# EAGLE design electric-imp (EAGLE 9.4.2)
Assembly variants: 10 mA, 50 mA

## Sheet 1 of 2
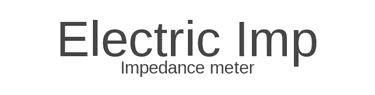
[diagram p0: schematic, sheet 1]

### Notes on the sheet
- Electric Imp
- Impedance meter

## Sheet 2 of 2: Power
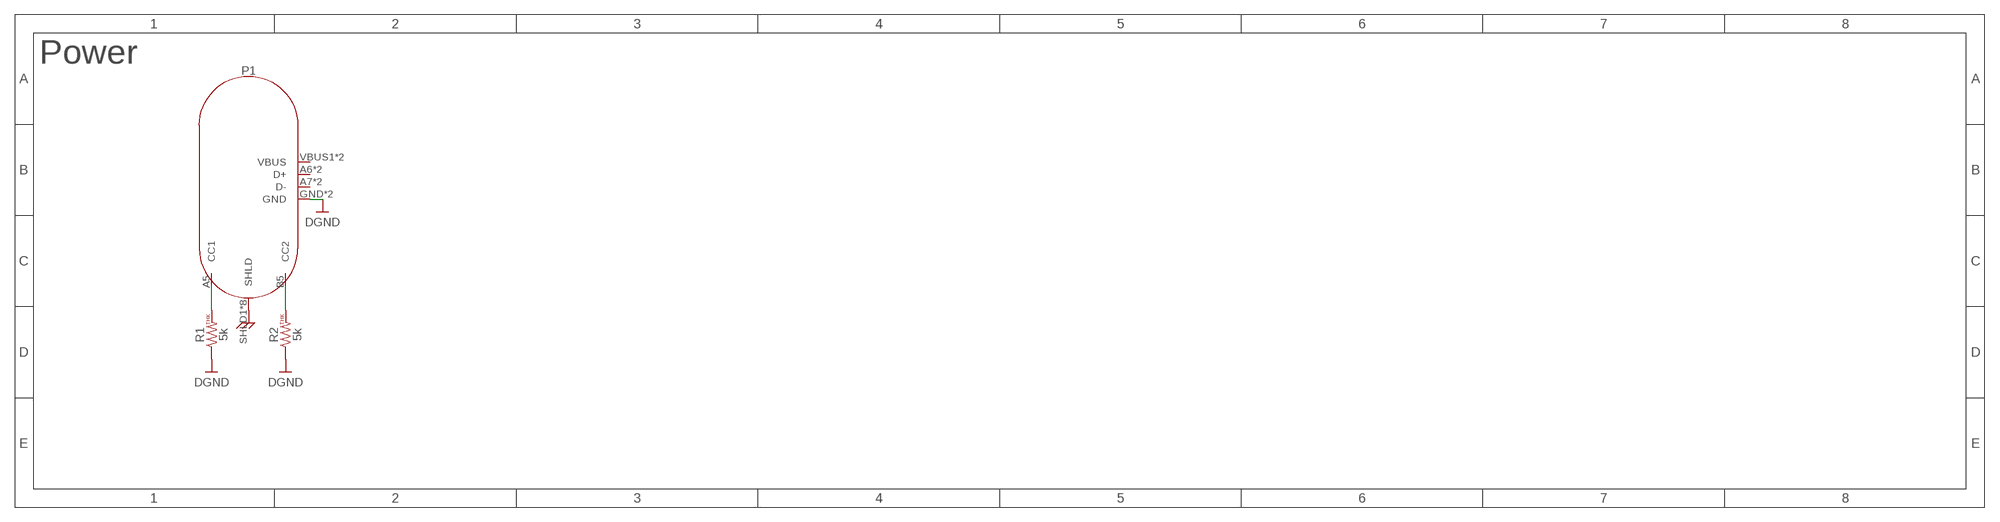
[diagram p1: schematic, sheet 2]

### Parts
P1  USB-C_2  [USB-C_2]
R1  5k  RESISTOR-5K-0603  [0603]
R2  5k  RESISTOR-5K-0603  [0603]

### Nets
DGND: P1.GND P1.GND2(GND) R1.1 R2.1
SHIELD: P1.SHLD1(SHLD) P1.SHLD2(SHLD) P1.SHLD3(SHLD) P1.SHLD4(SHLD) P1.SHLD5(SHLD) P1.SHLD6(SHLD) P1.SHLD7(SHLD) P1.SHLD8(SHLD)
UCPD1_CC1: P1.A5(CC1) R1.2
UCPD1_CC2: P1.B5(CC2) R2.2
Unconnected: P1.A6(D+) P1.A7(D-) P1.B6(D+) P1.B7(D-) P1.VBUS1(VBUS) P1.VBUS2(VBUS)

### Notes on the sheet
- Power

## Library data of the parts
P1 = usb:USB-C_2: USB-C connector with only USB-2.0 pins. Imported from Sparkfun connector library.; MANUF: BSC Electronics; PARTNUM: U06-CFXX5R-009-V1
R1 R2 = resistors:RESISTOR: Resistor, Thick Film; MANUF: Panasonic; PARTNUM: ERJ-3EKF4991V; TOLERANCE: 1%; TYPE: THICK FILM

## Net classes
0 default: width 0.25 mm, drill 0.15 mm

## Board
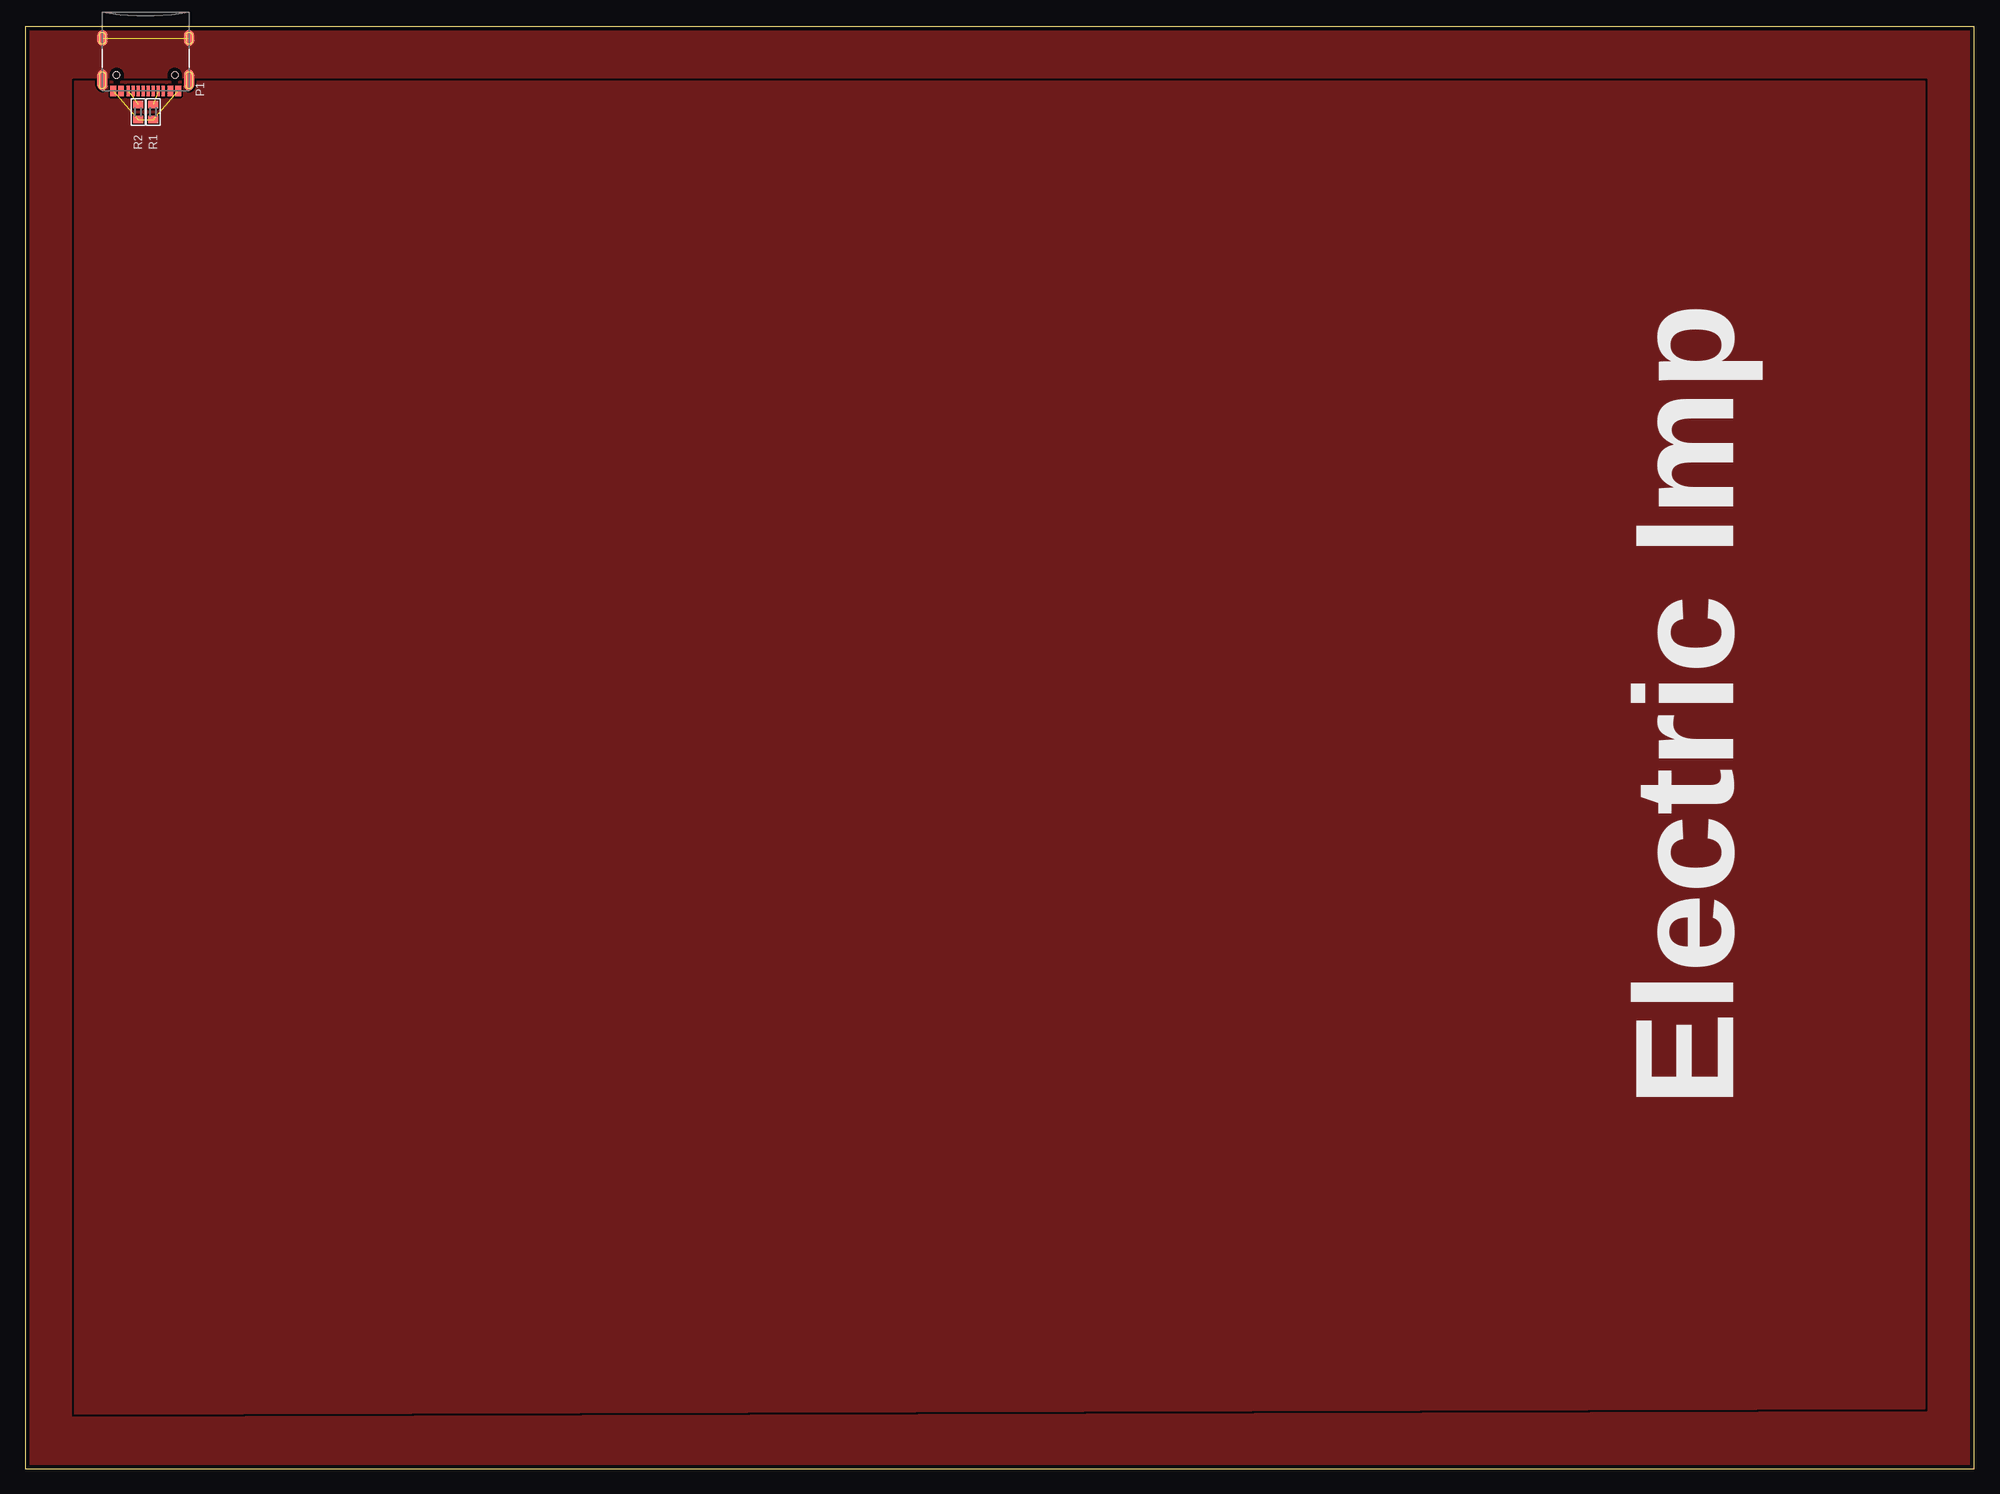
[diagram p2: board, top side]
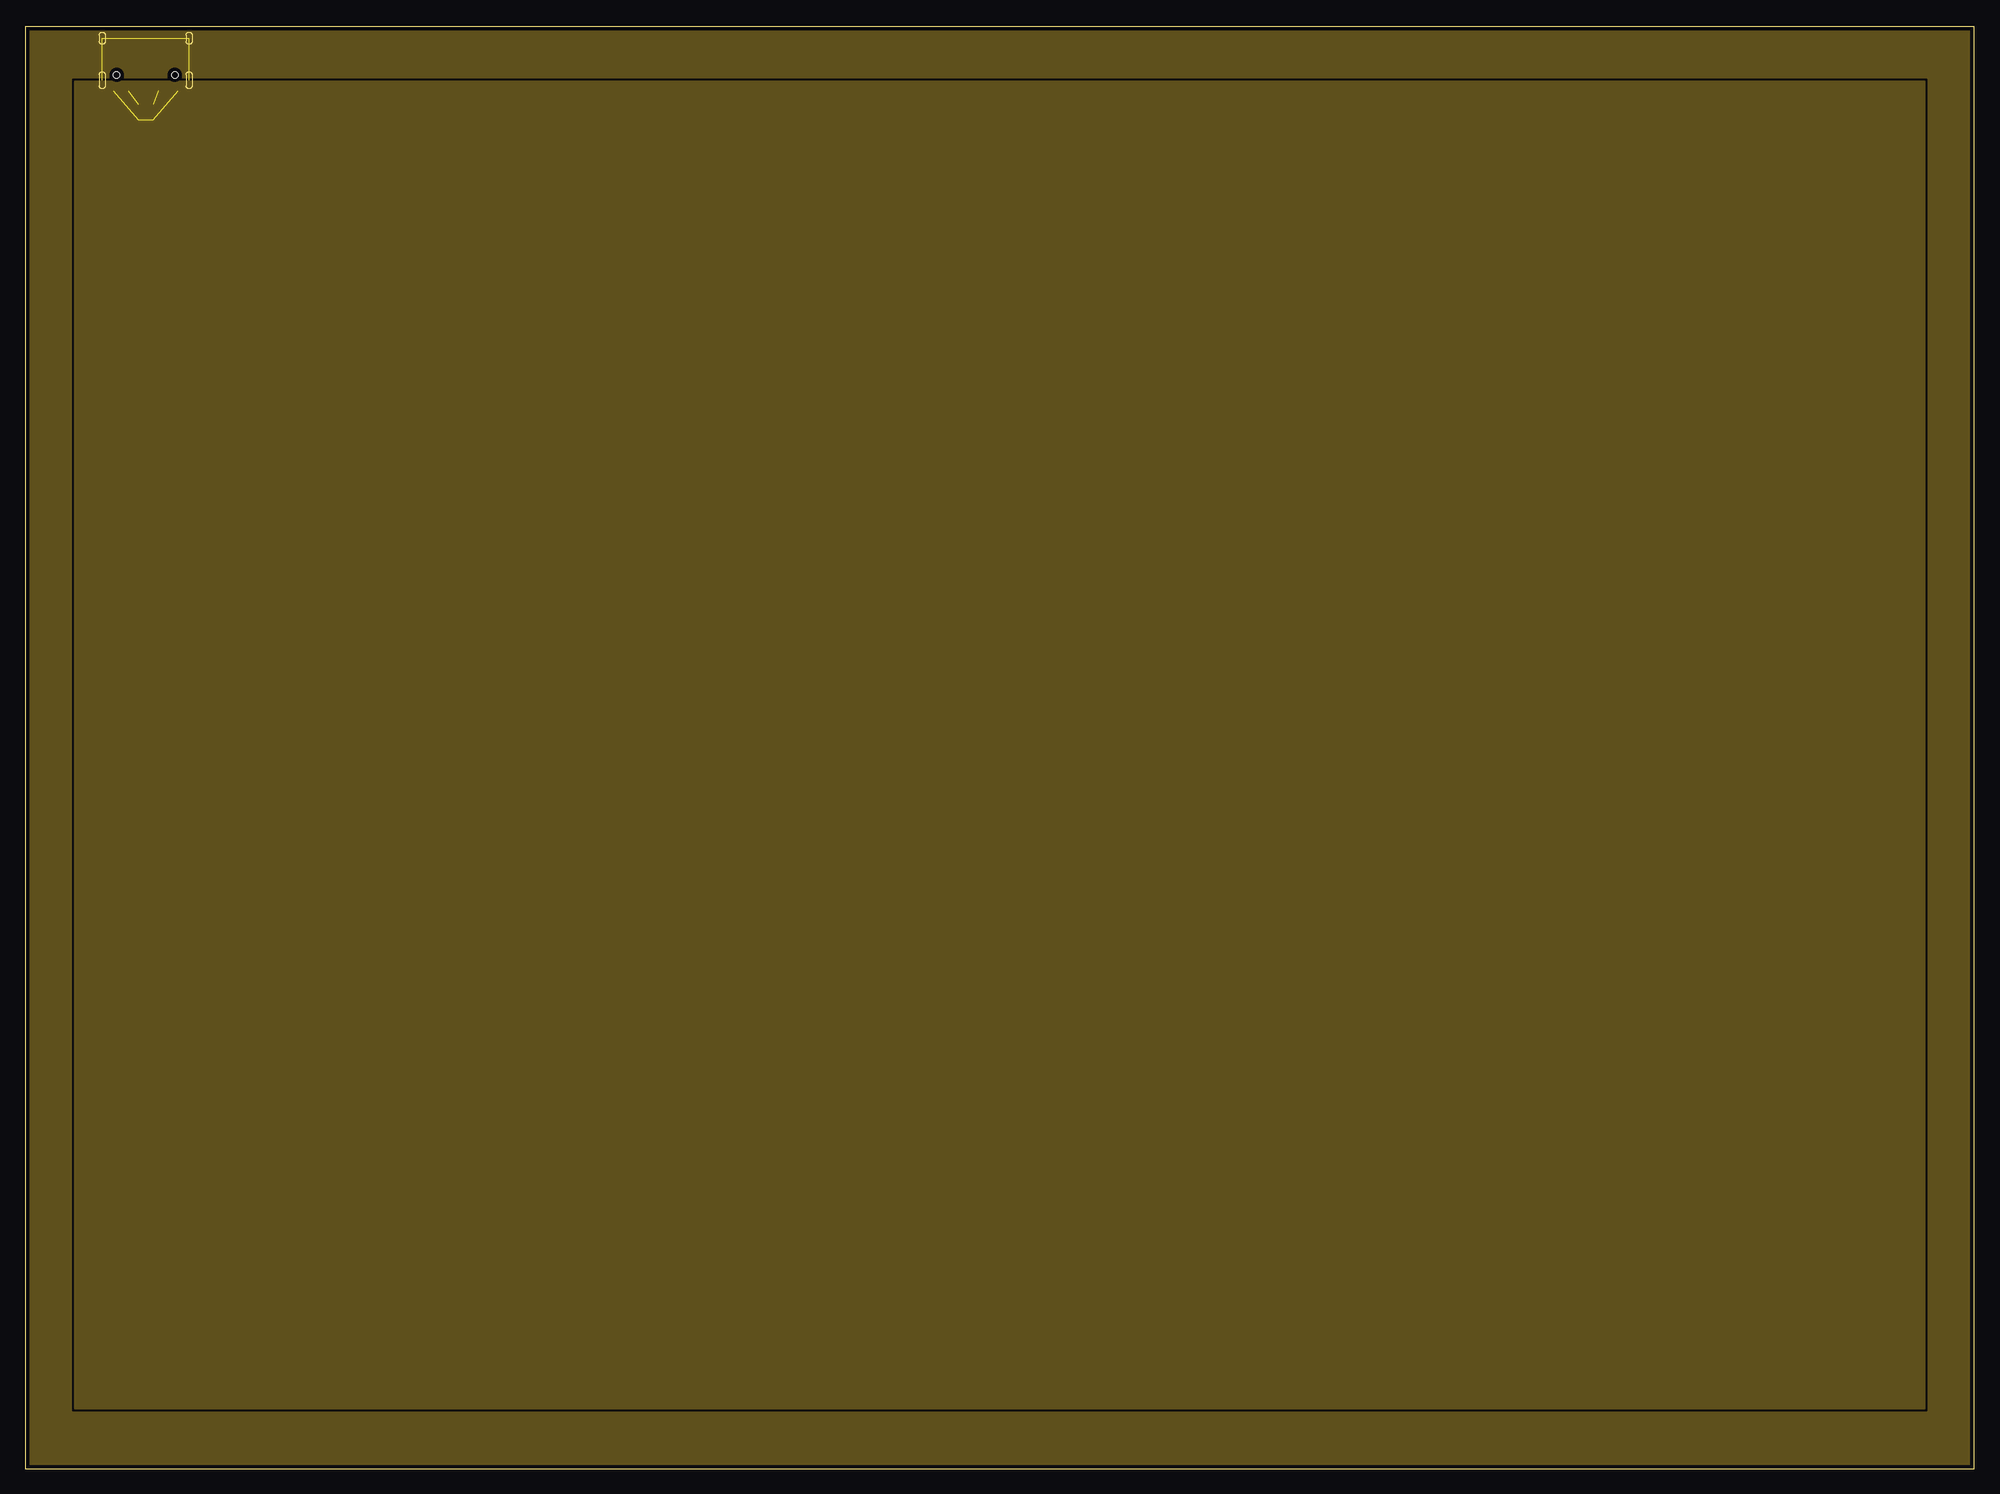
[diagram p3: board, inner layer Ground]
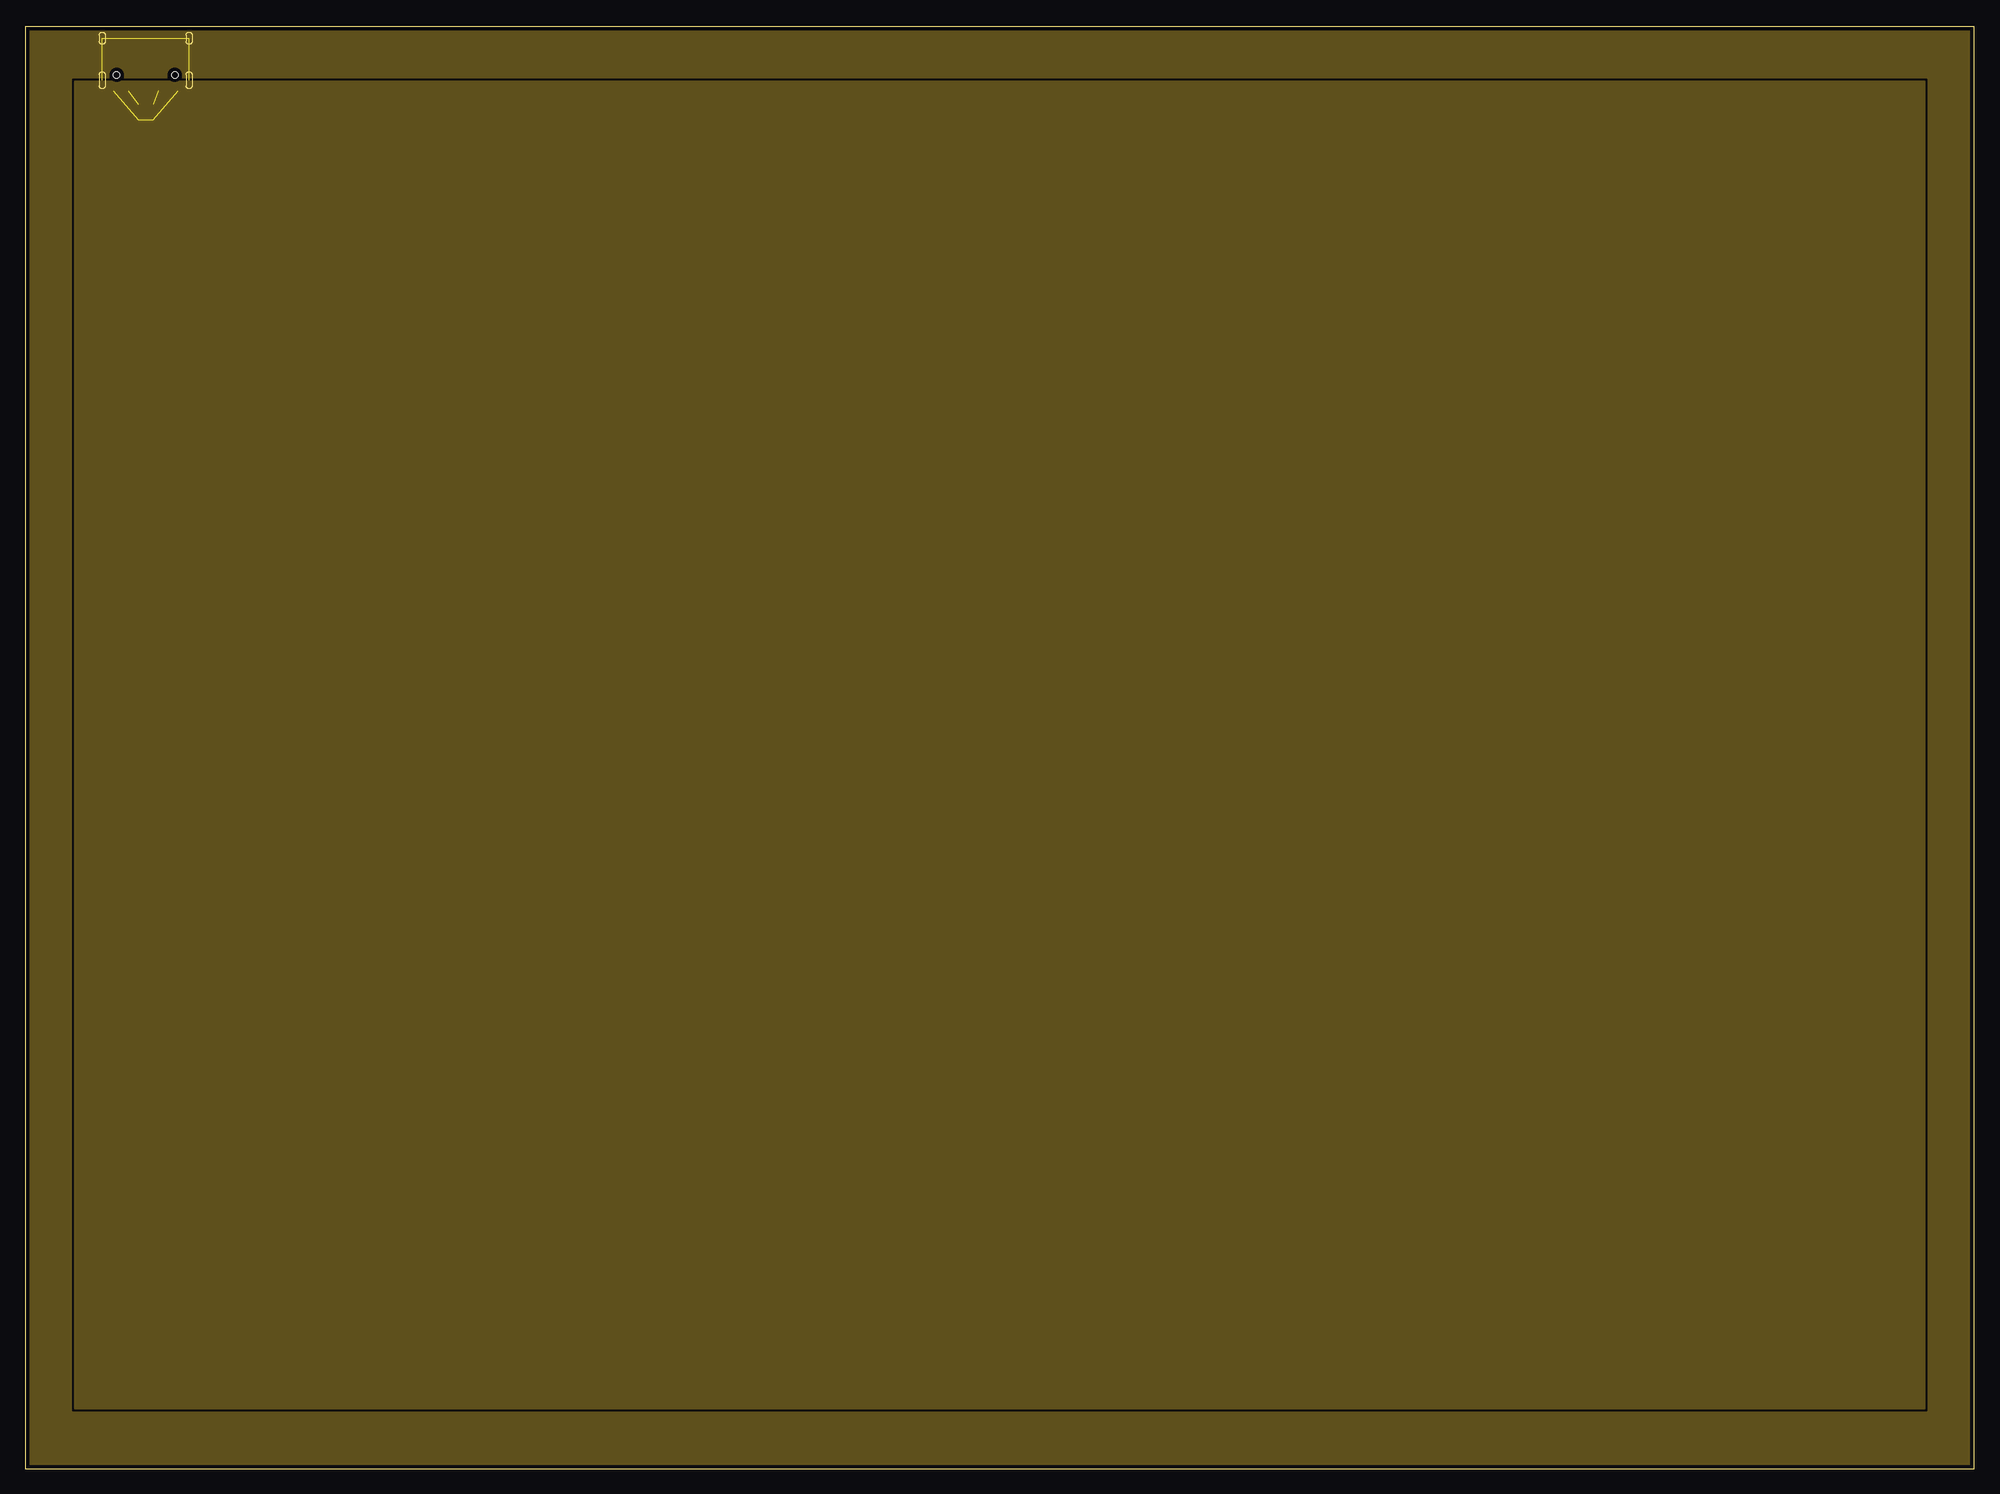
[diagram p4: board, inner layer Power]
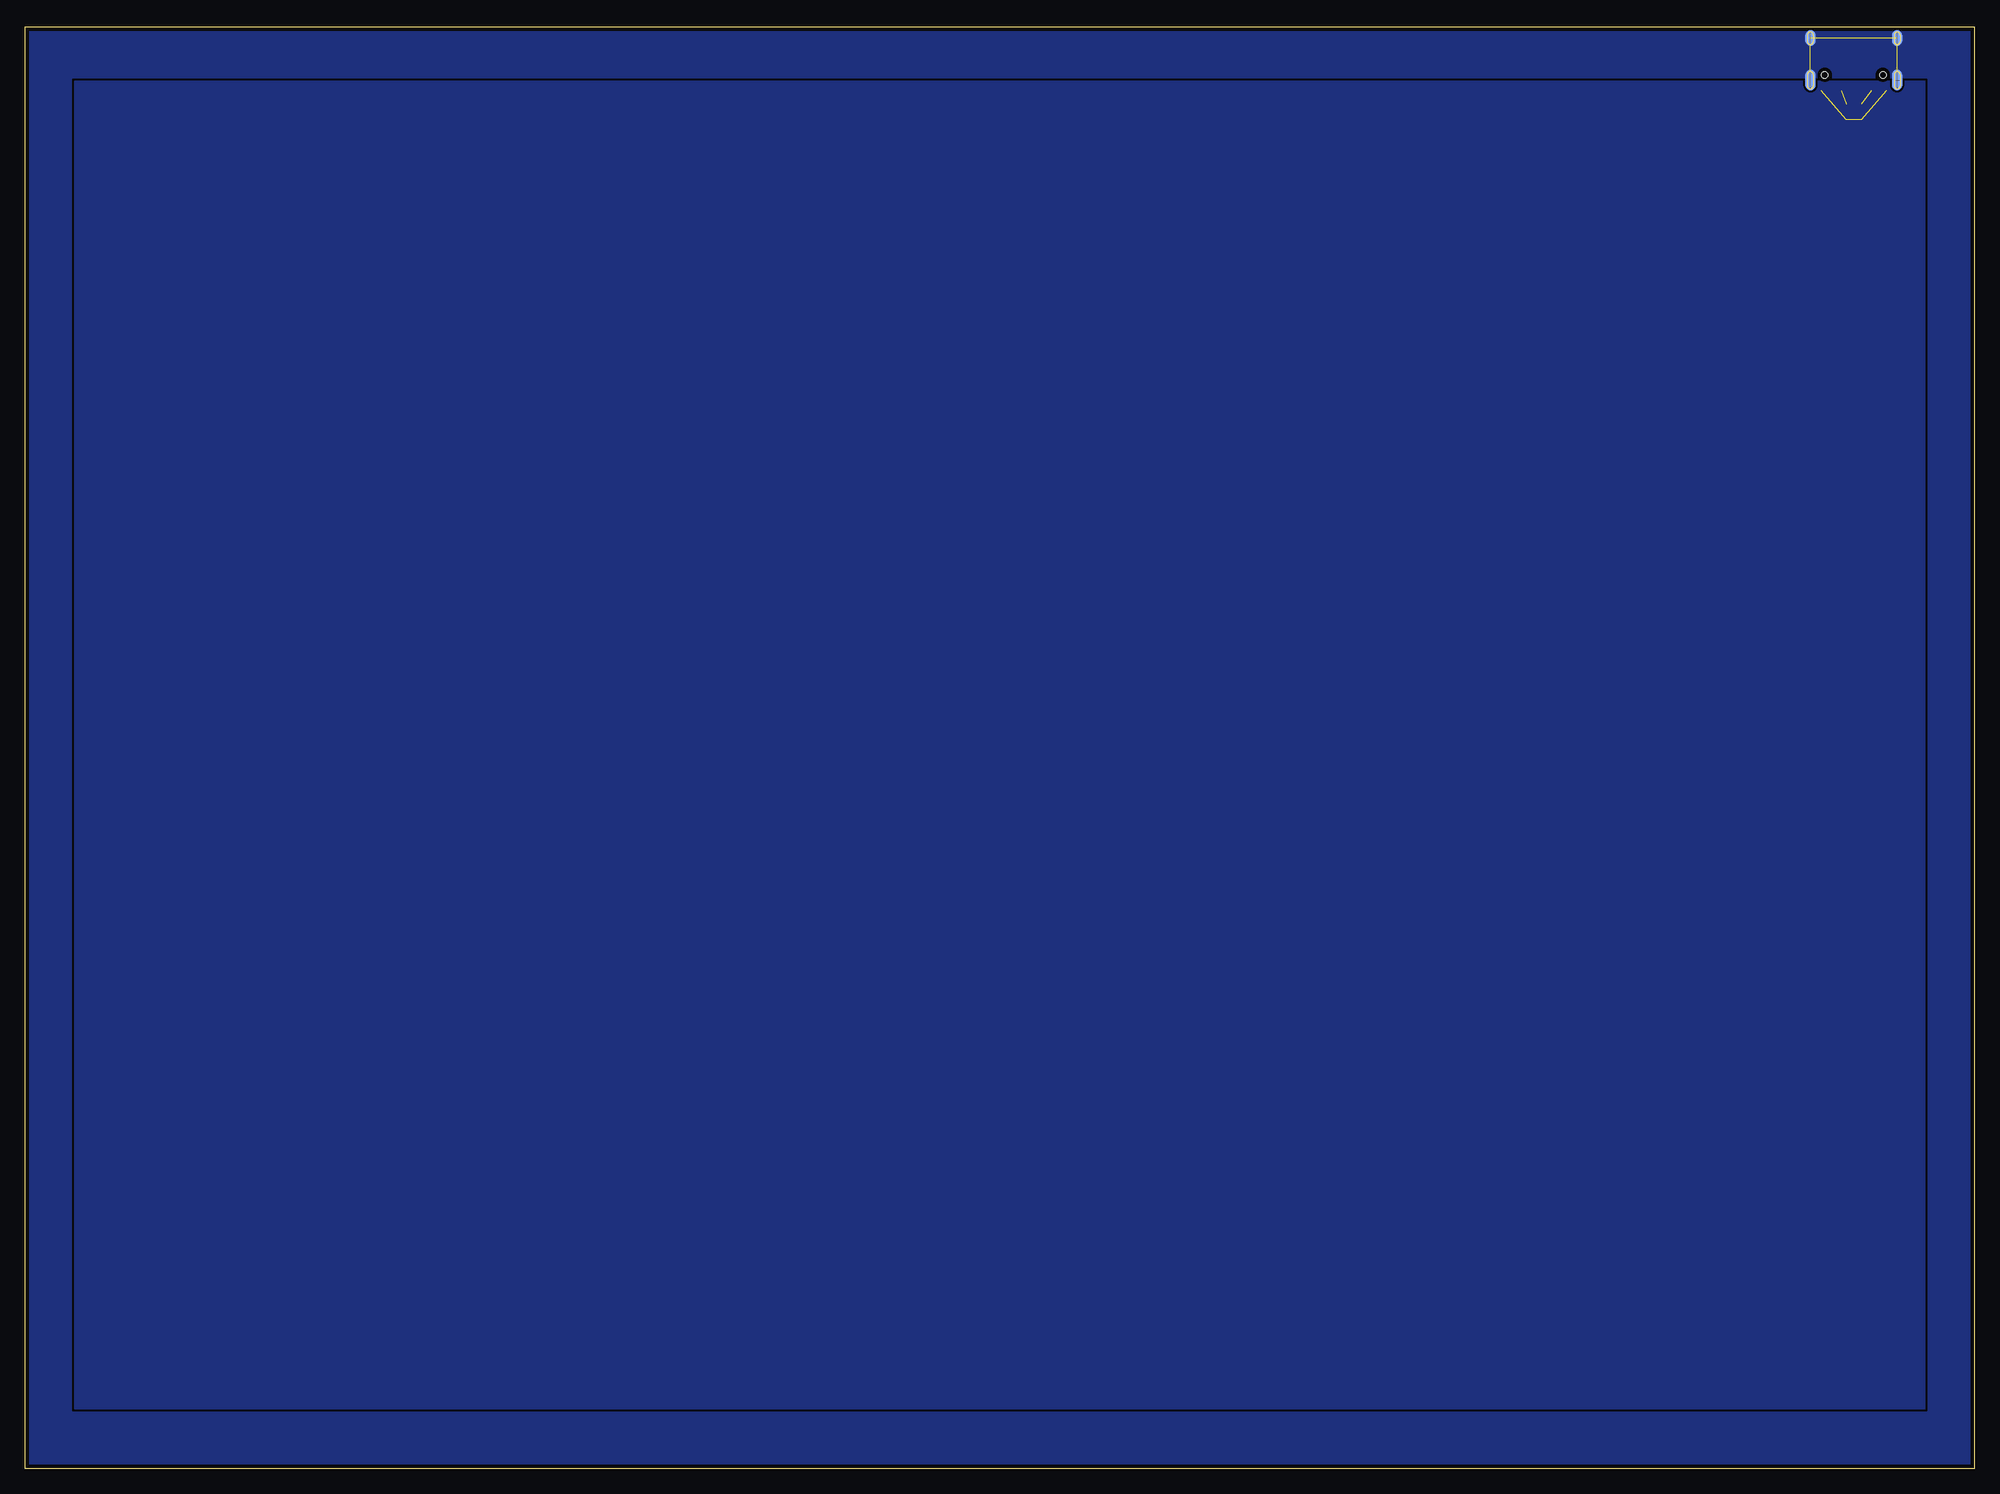
[diagram p5: board, bottom side, seen from below]

Size 194 x 143.5 mm. Coordinates in mm from the lower left corner, seen from the top.
Outline: 0,0 194,0 194,143.5 0,143.5 0,0
Copper layers (1*2+15*16): Top 0.035559375mm / dielectric 10mil / Ground 0.035559375mm / dielectric 10mil / Power 0.035559375mm / dielectric 10mil / Bottom 0.035559375mm
Design rules "Twinleaf 4 Layer, 8 mil *": minimum track width 8mil, minimum drill 10mil, track to track 8mil, track to pad 8mil, pad to pad 0.12191875mm, via to via 8mil, smd to smd 1mil, copper to edge 15mil, drill to drill 10mil, minimum pad ring 8mil, minimum via ring 8mil, stop-mask expansion 1mil, vias tented up to drill 40mil, thermal gap 10mil

### Footprints (pad centres in the part's own frame; a part is rotated, then mirrored left to right if it is on the bottom)
USB-C_2 = smd 0.3 x 1.016: A5 -1.25,0.154; A6 -0.25,0.154; A7 0.25,0.154; A8 1.25,0.154; B5 1.75,0.154; B6 0.75,0.154; B7 -0.75,0.154; B8 -1.75,0.154 | smd 0.6 x 1.016: GND -3.225,0.154; GND2 3.225,0.154 | smd 1 x 2.1: SHLD1 -4.32,-0.915; SHLD2 4.32,-0.915 | smd 1 x 2.1 bottom: SHLD3 -4.32,-0.915; SHLD4 4.32,-0.915 | smd 1 x 1.6: SHLD5 -4.32,-5.095; SHLD8 4.32,-5.095 | smd 1 x 1.6 bottom: SHLD6 -4.32,-5.095; SHLD7 4.32,-5.095 | smd 0.55 x 1.016: VBUS1 -2.45,0.154; VBUS2 2.45,0.154 | hole 0.65: -2.89,-1.445; 2.89,-1.445
0603 = smd 0.75 x 1: 1 -0.75,0; 2 0.75,0

### Placement (x,y rotation side)
P1  12,137.25 180 top
R1  12.75,135 90 top
R2  11.25,135 90 top

### Tracks (layer width: path | path; a pad name or v marks a point on that pad's centre or on a via)
AGND
  pour Top (rank 5): 5,138 189,138 189,6 5,5.5
  pour Bottom (rank 5, no thermals): 5,138 189,138 189,6 5,6
  pour Ground (rank 5, no thermals): 5,138 189,138 189,6 5,6
DGND  (3 unrouted)
P8VA
  pour Power (rank 5, no thermals): 5,138 189,138 189,6 5,6
SHIELD  (7 unrouted)
  pour Bottom (rank 6, no thermals): 0,143.5 194,143.5 194,0 0,0
  pour Top (rank 6, no thermals): 0,143.5 194,143.5 194,0 0,0
  pour Power (rank 6, no thermals): 0,143.5 194,143.5 194,0 0,0
  pour Ground (rank 6, no thermals): 0,143.5 194,143.5 194,0 0,0
UCPD1_CC1  (1 unrouted)
UCPD1_CC2  (1 unrouted)

### Text on the board
tPlace: Electric Imp